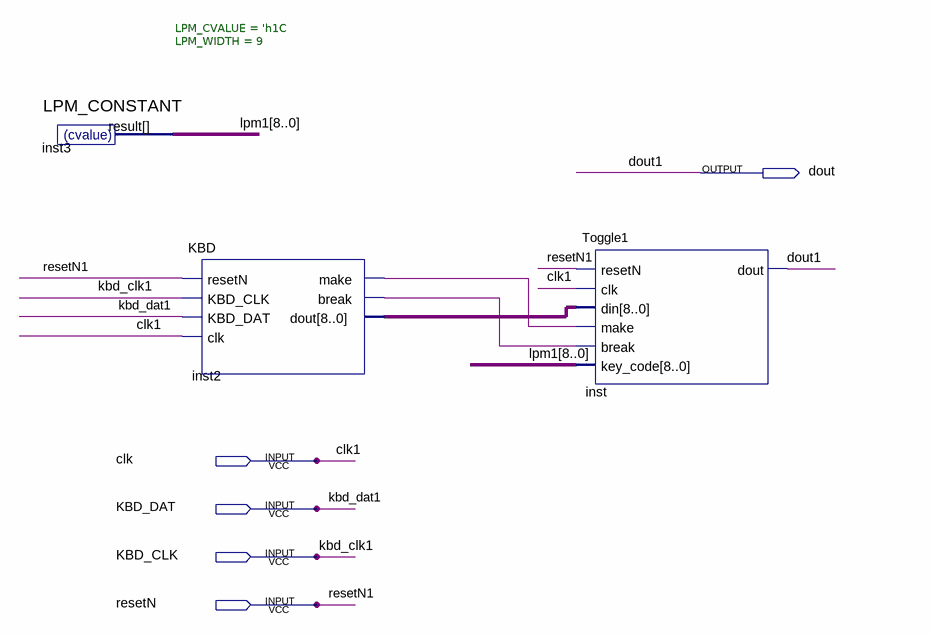
[diagram p0: schematic sheet]
// Quartus schematic A-press.bdf as structural Verilog: 3 symbols, 5 pins
module \A-press  (
  input  clk,
  input  KBD_DAT,
  input  KBD_CLK,
  input  resetN,
  output dout
);

  wire inst2_break, inst2_make;
  wire [8:0] inst2_dout, lpm1;

  LPM_CONSTANT #(.LPM_CVALUE('h1C), .LPM_WIDTH(9)) inst3 (.result(lpm1));
  KBD inst2 (
    .resetN(resetN), .KBD_CLK(KBD_CLK), .KBD_DAT(KBD_DAT), .clk(clk), .make(inst2_make),
    .\break (inst2_break), .dout(inst2_dout));
  Toggle1 inst (
    .resetN(resetN), .clk(clk), .din(inst2_dout), .make(inst2_make), .\break (inst2_break), .key_code(lpm1),
    .dout(dout));

  // Other names for the same wires on the sheet: clk1 = clk; dout1 = dout; kbd_clk1 = KBD_CLK; kbd_dat1 = KBD_DAT;
  //   resetN1 = resetN
endmodule
